# EAGLE design Arduino MEGA blank shield (EAGLE 9.1.2)
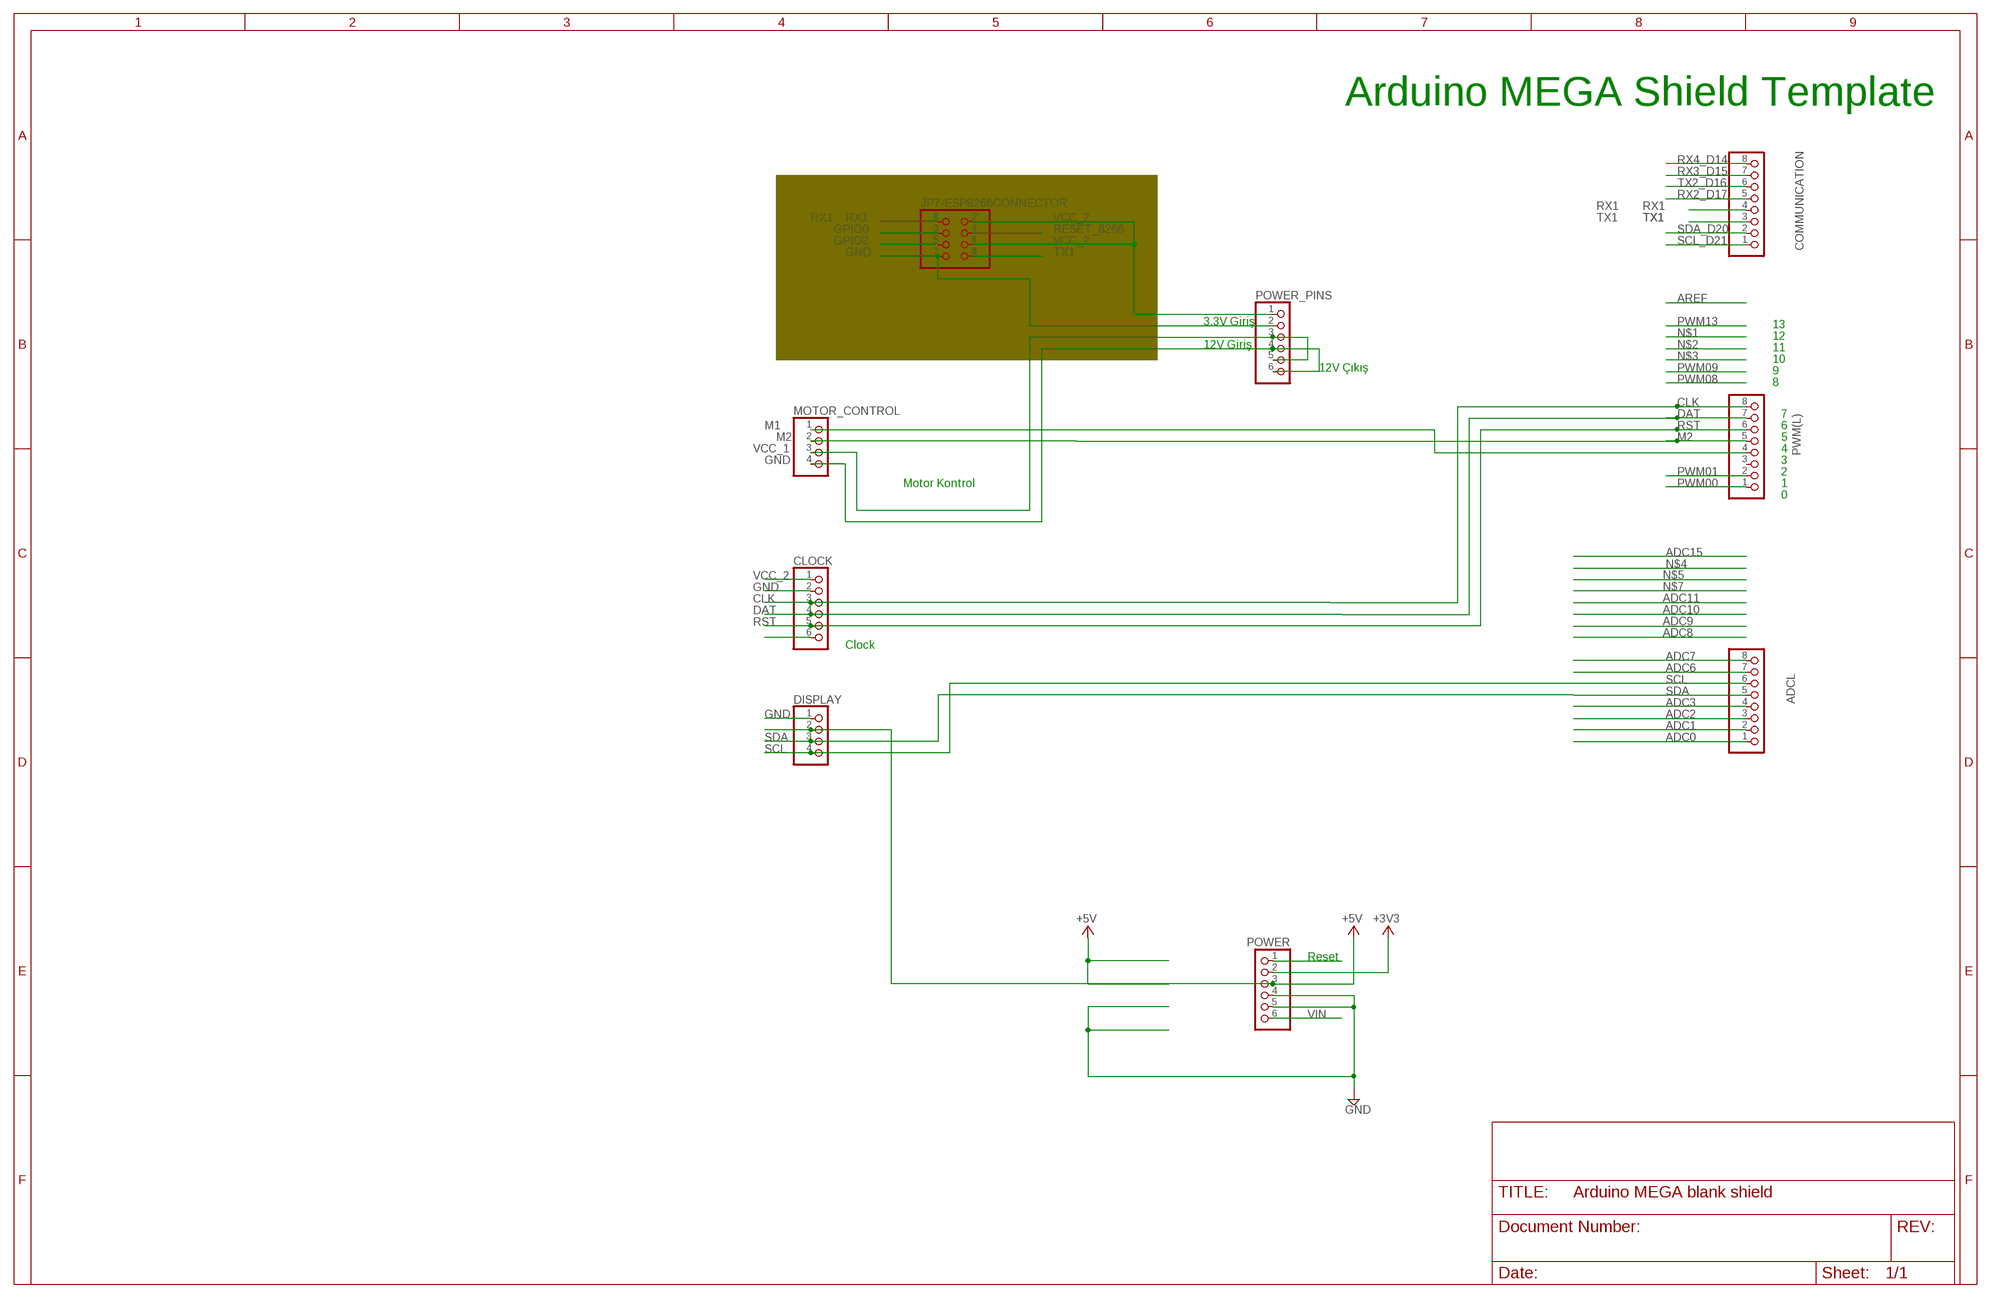
[diagram p0: schematic, sheet 1]

## Parts
ADCL  PINHD-1X8  [1X08]
CLOCK  PINHD-1X6  [1X06]
COMMUNICATION  PINHD-1X8  [1X08]
DISPLAY  PINHD-1X4  [1X04]
JP7-ESP8266CONNECTOR  PINHD-2X4  [2X04]
MOTOR_CONTROL  PINHD-1X4  [1X04]
POWER  PINHD-1X6  [1X06]
POWER_PINS  PINHD-1X6  [1X06]
PWM(L)  PINHD-1X8  [1X08]

## Nets
+3V3 [power]: POWER.2
+5V [usbvcc]: DISPLAY.2 POWER.3
ADC0: ADCL.1
ADC1: ADCL.2
ADC2: ADCL.3
ADC3: ADCL.4
ADC6: ADCL.7
ADC7: ADCL.8
CLK: CLOCK.3 PWM(L).8
DAT: CLOCK.4 PWM(L).7
GND [gnd]: CLOCK.2 DISPLAY.1 JP7-ESP8266CONNECTOR.7 MOTOR_CONTROL.4(GND) POWER.4 POWER.5 POWER_PINS.2 POWER_PINS.4 POWER_PINS.6
GPIO0: JP7-ESP8266CONNECTOR.3
GPIO2: JP7-ESP8266CONNECTOR.5
M1: MOTOR_CONTROL.1 PWM(L).4
M2: MOTOR_CONTROL.2 PWM(L).5
N$6: CLOCK.6
PWM00: PWM(L).1
PWM01: PWM(L).2
RESET: POWER.1
RESET_8266: JP7-ESP8266CONNECTOR.4
RST: CLOCK.5 PWM(L).6
RX1: COMMUNICATION.4 JP7-ESP8266CONNECTOR.1
RX2_D17: COMMUNICATION.5
RX3_D15: COMMUNICATION.7
RX4_D14: COMMUNICATION.8
SCL: ADCL.6 DISPLAY.4(GND)
SCL_D21: COMMUNICATION.1
SDA: ADCL.5 DISPLAY.3
SDA_D20: COMMUNICATION.2
TX1: COMMUNICATION.3 JP7-ESP8266CONNECTOR.8
TX2_D16: COMMUNICATION.6
VCC_1: MOTOR_CONTROL.3 POWER_PINS.3 POWER_PINS.5
VCC_2: CLOCK.1 JP7-ESP8266CONNECTOR.2 JP7-ESP8266CONNECTOR.6 POWER_PINS.1
VIN [power]: POWER.6
Unconnected: PWM(L).3

## Notes on the sheet
- Arduino MEGA Shield Template
- 3.3V Giriş | 13
- 12
- 12V Giriş | 11
- 10
- 12V Çıkış | 9
- 8
- 7
- 6
- 5
- 4
- 3
- 2
- Motor Kontrol | 1
- 0
- Clock
- Reset

## Library data of the parts
ADCL COMMUNICATION PWM(L) = pinhead:PINHD-1X8: PIN HEADER
CLOCK POWER POWER_PINS = pinhead:PINHD-1X6: PIN HEADER
DISPLAY = pinhead:PINHD-1X4: PIN HEADER
JP7-ESP8266CONNECTOR = pinhead:PINHD-2X4: PIN HEADER
MOTOR_CONTROL = pinhead:PINHD-1X4: PIN HEADER; SPICEPREFIX: E

## Net classes
0 default: width 0.203 mm, drill 0.406 mm, clearance 0.203 mm
1 power: width 0.61 mm, drill 0.711 mm, clearance 0.203 mm
2 gnd: width 0.305 mm, drill 0.711 mm, clearance 0.203 mm
3 usbvcc: width 0.508 mm, drill 0.711 mm, clearance 0.203 mm

## Board
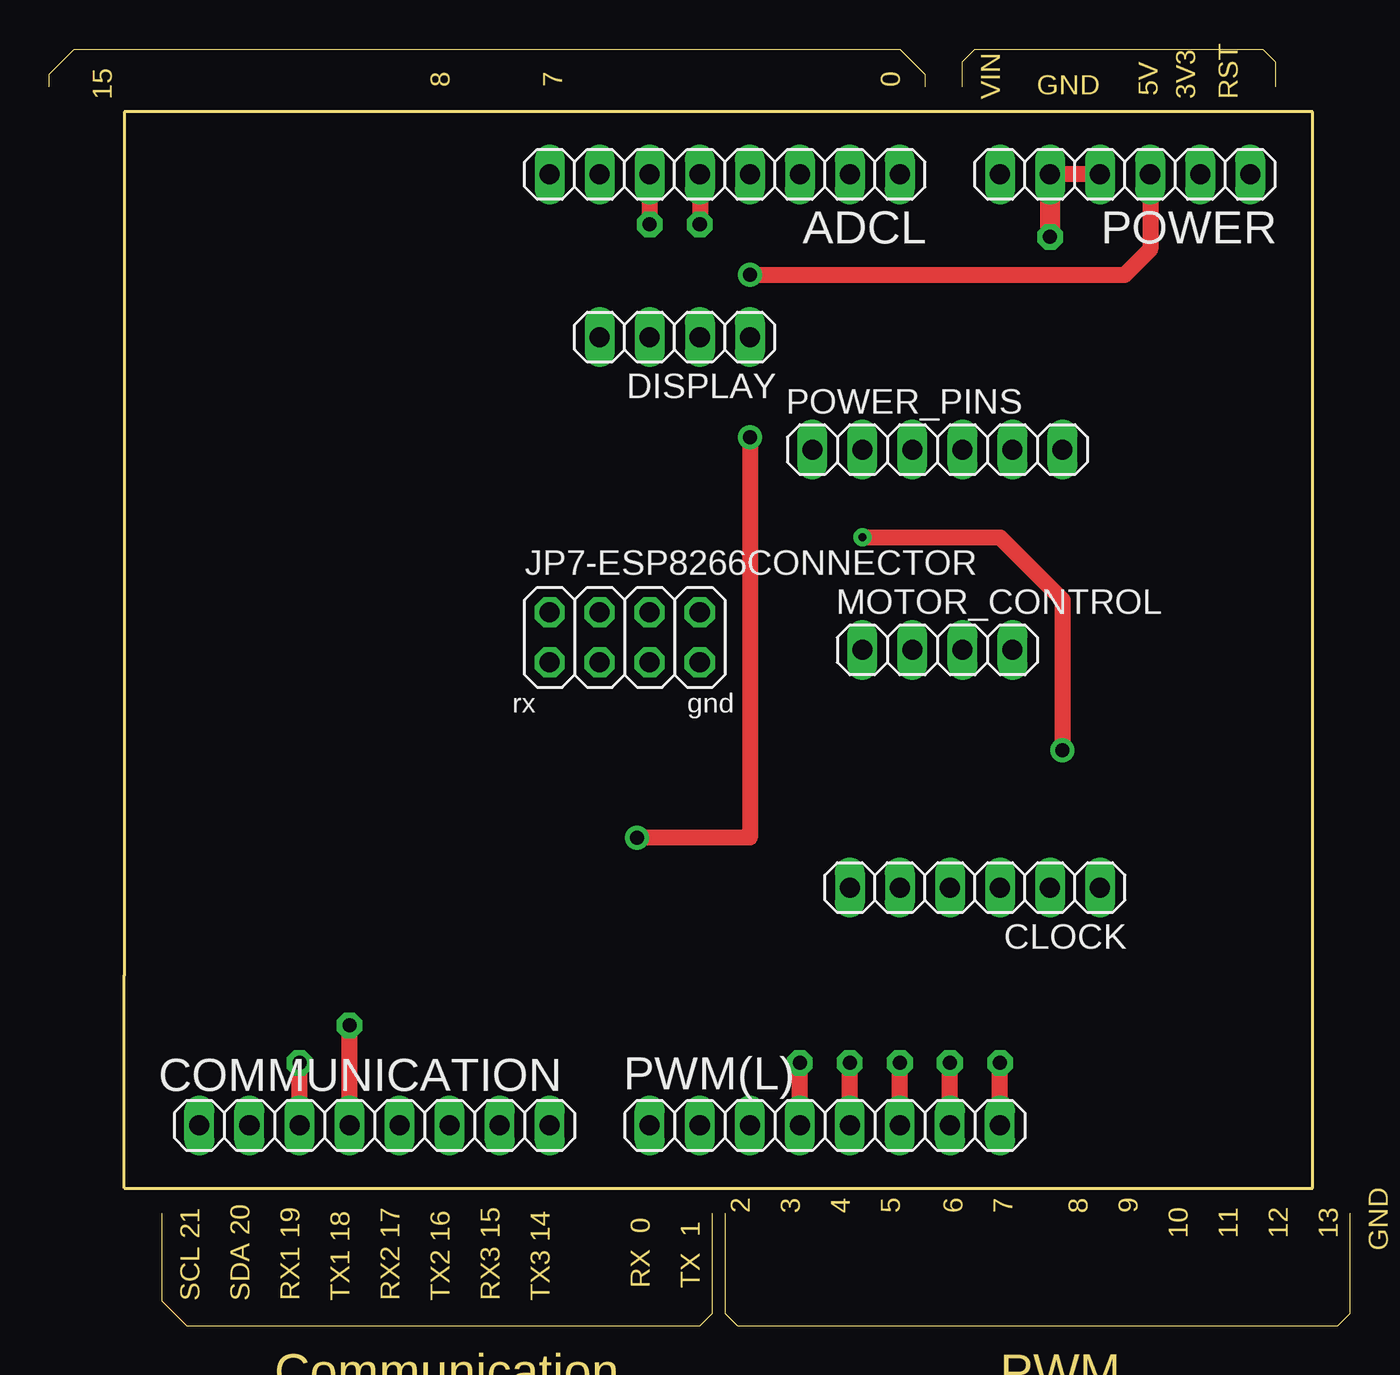
[diagram p1: board, top side]
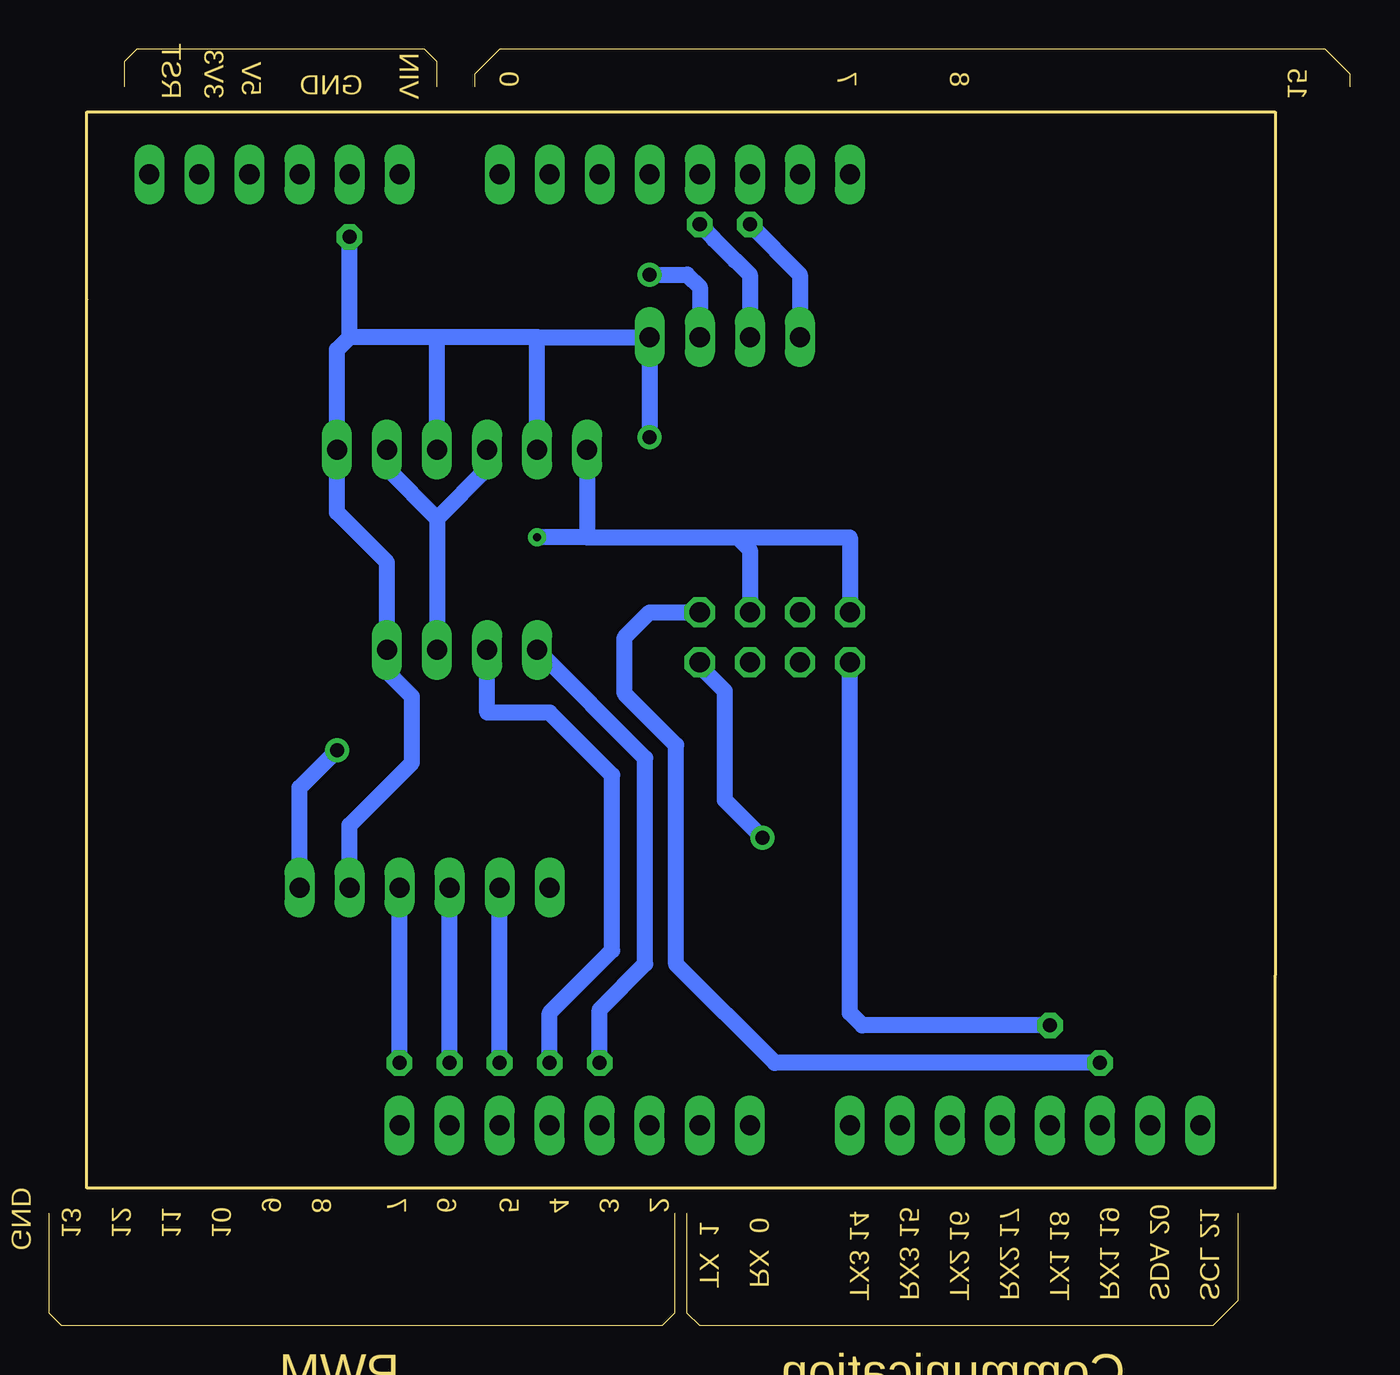
[diagram p2: board, bottom side, seen from below]

Size 66.04 x 64.77 mm. Coordinates in mm from the lower left corner, seen from the top.
Outline: 0,62.86 0,63.5 1.27,64.77 43.18,64.77 44.45,63.5 44.45,62.86
Outline: 46.35,62.86 46.35,64.13 46.99,64.77 61.6,64.77 62.23,64.13 62.23,62.86
Outline: 5.71,5.71 5.71,1.27 6.98,0 33.02,0 33.66,0.63 33.66,5.71
Outline: 34.29,5.71 34.29,0.63 34.92,0 65.41,0 66.04,0.63 66.04,5.71
Outline: 3.81,6.98 64.13,6.98 64.13,52.07 64.13,61.59 3.81,61.59 3.81,17.78 3.81,6.98
Copper layers (1*16): Top 0.035mm / dielectric 1.5mm / Bottom 0.035mm
Design rules "default *": minimum track width 32mil, minimum drill 16mil, track to track 30mil, track to pad 30mil, pad to pad 30mil, via to via 30mil, smd to smd 8mil, copper to edge 40mil, drill to drill 12mil, minimum pad ring 10mil, minimum via ring 10mil, stop-mask expansion 4mil, vias tented up to drill 0mil, thermal gap 10mil

### Footprints (pad centres in the part's own frame; a part is rotated, then mirrored left to right if it is on the bottom)
1X08 = drill 1.016 long: 1 -8.89,0; 2 -6.35,0; 3 -3.81,0; 4 -1.27,0; 5 1.27,0; 6 3.81,0; 7 6.35,0; 8 8.89,0
1X06 = drill 1.016 long: 1 -6.35,0; 2 -3.81,0; 3 -1.27,0; 4 1.27,0; 5 3.81,0; 6 6.35,0
1X04 = drill 1.016 long: 1 -3.81,0; 2 -1.27,0; 3 1.27,0; 4 3.81,0
2X04 = drill 1.016 octagon: 1 -3.81,-1.27; 2 -3.81,1.27; 3 -1.27,-1.27; 4 -1.27,1.27; 5 1.27,-1.27; 6 1.27,1.27; 7 3.81,-1.27; 8 3.81,1.27

### Placement (x,y rotation side)
ADCL  34.29,58.42 180 top
CLOCK  46.99,22.23 180 top
COMMUNICATION  16.51,10.16 0 top
DISPLAY  31.75,50.17 180 top
JP7-ESP8266CONNECTOR  29.21,34.92 0 top
MOTOR_CONTROL  45.09,34.29 0 top
POWER  54.61,58.42 180 top
POWER_PINS  45.09,44.45 0 top
PWM(L)  39.37,10.16 0 top

### Tracks (layer width: path | path; a pad name or v marks a point on that pad's centre or on a via)
+5V  (via drill 0.71)
  Top 0.813: POWER.3 55.88,54.61 54.59,53.33 54.58,53.34 v35.56,53.34
  Bottom 0.813: v35.56,53.34 33.66,53.34 33.02,52.7 DISPLAY.2
CLK  (via drill 0.71 pad 1.3)
  Top 0.813: PWM(L).8 v48.26,13.34
  Bottom 0.813: v48.26,13.34 CLOCK.3
DAT  (via drill 0.71 pad 1.3)
  Top 0.813: PWM(L).7 v45.72,13.34
  Bottom 0.813: v45.72,13.34 CLOCK.4
GND  (via drill 0.71, 0.71 pad 1.3)
  Top 0.813: POWER.4 POWER.5 | v35.56,45.08 35.56,24.77 v29.84,24.77
  Top 1.016: POWER.5 v50.8,55.25
  Bottom 0.813: CLOCK.2 50.8,25.4 47.62,28.57 47.62,31.92 48.9,33.19 MOTOR_CONTROL.4 48.9,38.73 51.44,41.28 POWER_PINS.6 51.44,49.53 50.8,50.17 | v35.56,45.08 DISPLAY.1 41.27,50.17 | v29.84,24.77 31.75,26.67 31.75,32.19 33.02,33.47 JP7-ESP8266CONNECTOR.7 | POWER_PINS.2 41.27,50.17 | 50.8,50.17 v50.8,55.25 | 41.27,50.17 46.35,50.17 | 46.35,50.17 50.8,50.17 | POWER_PINS.4 46.35,50.17
M1  (via drill 0.71 pad 1.3)
  Top 0.813: PWM(L).4 v38.1,13.34
  Bottom 0.813: v38.1,13.34 38.1,16.04 35.79,18.36 35.79,28.8 MOTOR_CONTROL.1
M2  (via drill 0.71 pad 1.3)
  Top 0.813: PWM(L).5 v40.64,13.34
  Bottom 0.813: v40.64,13.34 40.64,15.88 37.46,19.05 37.46,27.94 40.64,31.11 43.81,31.11 MOTOR_CONTROL.2
RST  (via drill 0.71 pad 1.3)
  Top 0.813: PWM(L).6 v43.18,13.34
  Bottom 0.813: v43.18,13.34 CLOCK.5
RX1  (via drill 0.71 pad 1.3)
  Top 0.813: COMMUNICATION.4 v15.24,15.24
  Bottom 0.813: v15.24,15.24 24.77,15.24 25.4,15.88 JP7-ESP8266CONNECTOR.1
SCL  (via drill 0.71 pad 1.3)
  Top 0.813: ADCL.6 v30.48,55.88
  Bottom 0.813: v30.48,55.88 27.94,53.34 DISPLAY.4
SDA  (via drill 0.71 pad 1.3)
  Top 0.813: ADCL.5 v33.02,55.88
  Bottom 0.813: DISPLAY.3 30.48,53.34 31.2,54.06 31.23,54.06 32.3,55.13 32.3,55.16 v33.02,55.88
TX1  (via drill 0.71 pad 1.3)
  Top 0.813: COMMUNICATION.3 v12.7,13.34
  Bottom 0.813: v12.7,13.34 29.21,13.34 34.21,18.34 34.21,29.46 36.83,32.07 36.83,34.92 35.56,36.19 JP7-ESP8266CONNECTOR.8
VCC_1
  Bottom 0.813: 46.35,40.96 MOTOR_CONTROL.3 | POWER_PINS.3 43.81,43.5 46.35,40.96 | 46.35,40.96 48.9,43.5 POWER_PINS.5
VCC_2  (via drill 0.41, 0.71)
  Top 0.813: v41.27,40 48.26,40 51.44,36.83 v51.44,29.21
  Bottom 0.813: CLOCK.1 53.34,27.31 v51.44,29.21 | 38.73,40 31.12,40 | 31.12,40 30.48,39.37 JP7-ESP8266CONNECTOR.6 | 31.12,40 25.4,40 JP7-ESP8266CONNECTOR.2 | 38.73,40 v41.27,40 | POWER_PINS.1 38.73,40

### Text on the board
Dimension: 5V | 3V3 | 8 | 7 | 0 | GND | 15 | VIN | RST | 2 | 3 | 4 | 5 | 6 | 7 | 8 | 9 | 10 | 11 | 12 | 13 | GND | AREF | RX 0 | TX 1 | SCL 21 | SDA 20 | RX1 19 | TX1 18 | RX2 17 | TX2 16 | RX3 15 | TX3 14 | Communication | PWM
tOrigins: Analog In | Power
tNames: rx | gnd